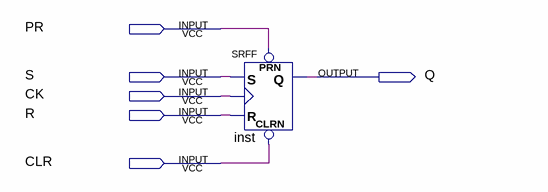
[diagram p0: schematic sheet]
// Quartus schematic RS_FF.bdf as structural Verilog: 1 symbols, 6 pins
module RS_FF (
  input  PR,
  input  S,
  input  CK,
  input  R,
  input  CLR,
  output Q
);

  SRFF inst (.PRN(PR), .CLRN(CLR), .S(S), .R(R), .CLK(CK), .Q(Q));
endmodule
